# Altium schematic sheet power.SchDoc
size A4; SheetNumber: 5; SheetTotal: 8
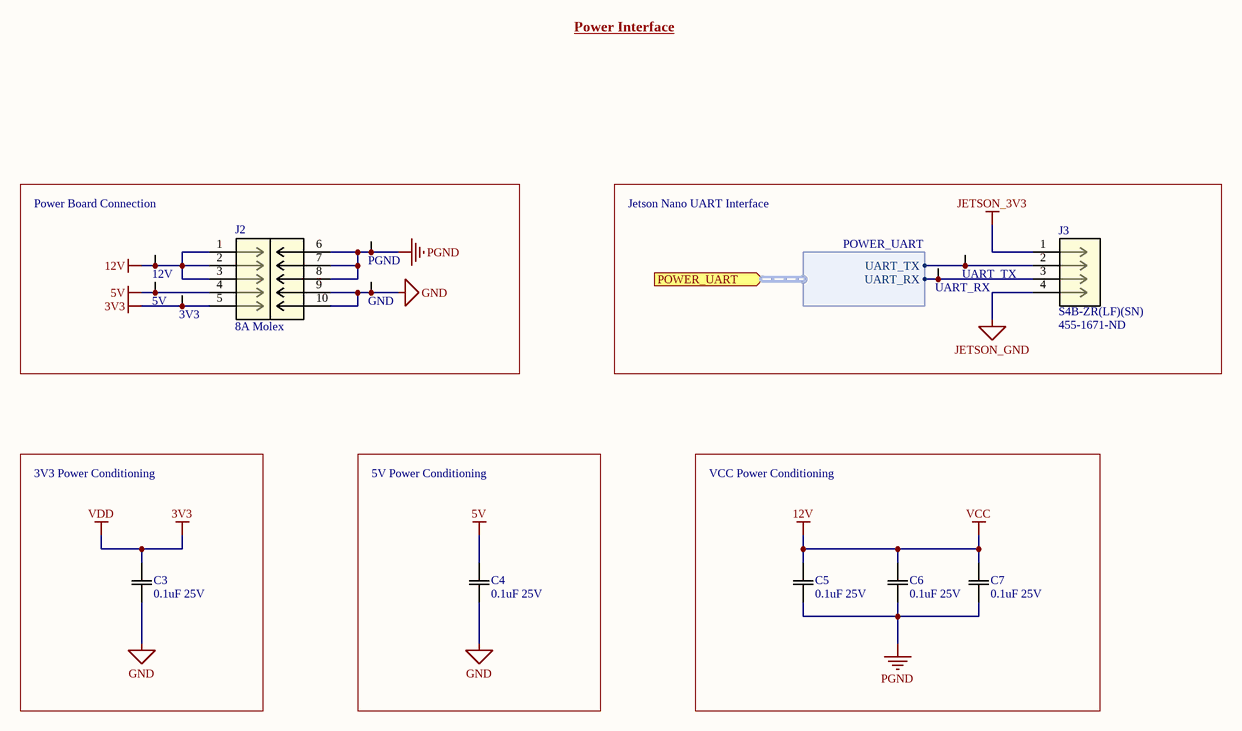
[diagram p0: power.SchDoc]

## Parts
3V3  Test Point (Via)  [TP]  (value not drawn)
5V  Test Point (Via)  [TP]  (value not drawn)
12V  Test Point (Via)  [TP]  (value not drawn)
C3  0.1uF 25V  [0805]
C4  0.1uF 25V  [0805]
C5  0.1uF 25V  [0805]
C6  0.1uF 25V  [0805]
C7  0.1uF 25V  [0805]
GND  Test Point (Via)  [TP]  (value not drawn)
J2  8A Molex  [MOLEX_0430451012]
J3  S4B-ZR(LF)(SN)  Supplier Part Number 1: 455-1671-ND  [CN S4B-ZR(LF)(SN)_JST]
PGND  Test Point (Via)  [TP]  (value not drawn)
UART_RX  Test Point (Via)  [TP]  (value not drawn)
UART_TX  Test Point (Via)  [TP]  (value not drawn)

## Blocks framed on the sheet
Power Board Connection: 3V3 5V 12V GND J2 PGND
Jetson Nano UART Interface: J3 UART_RX UART_TX
3V3 Power Conditioning: C3
5V Power Conditioning: C4
VCC Power Conditioning: C5-C7

## Ports
POWER_UART (in, harness POWER_UART)

## Harnesses
POWER_UART: UART_TX, UART_RX

## Nets
3V3: 3V3.1 C3.1(C1) J2.5  [also labelled VDD]
5V: 5V.1 C4.1(C1) J2.4
12V: 12V.1 C5.1(C1) C6.1(C1) C7.1(C1) J2.1 J2.2 J2.3  [also labelled VCC]
GND: C3.2(C2) C4.2(C2) GND.1 J2.9 J2.10
JETSON_3V3: J3.1
JETSON_GND: J3.4
PGND: C5.2(C2) C6.2(C2) C7.2(C2) J2.6 J2.7 J2.8 PGND.1
NetJ3_2: J3.2 UART_TX.1 ; port POWER_UART.UART_TX
NetJ3_3: J3.3 UART_RX.1 ; port POWER_UART.UART_RX

## Notes on the sheet
- Power Interface

## Library data of the parts
C3-C7 = CAP 0.1uF 25V: CAP CER 0.1UF 25V X7R 0805/0603; Tolerance: 10%; Value: 0.1uF; Temperature Coefficient: X7R; Rating: 25V; Operating Temperature: -55°C ~ 125°C
J2 = CN HDR 10POS MOLEX 0430451012: CONN HEADER VERT 10POS 3MM; Number of Terminals/Pins: 10; Contact Resistance: 10mR; Connector Type: Male Pin; Number of Ports: 1; Max Voltage Rating (AC): 250V; Pitch: 0.118inch; Supplier 1: Digi-Key; Manufacturer: Molex; Manufacturer Part Number: 0430451012; RoHS: Yes; Category: Headers and Wire Housings; Stock 1: 22123; Pricing 1: 1=2.46000, 10=2.09300, 80=1.72925, 1224=1.36521, 6120=1.21049 (USD); Mount: Through Hole; Color: Black; Contact Material: Brass; Contact Plating: Tin; Housing Color: Black; Housing Material: Polymer; Min Operating Temperature: -40°C; Max Operating Temperature: 105°C; Packaging: Tray; Number of Rows: 2; Number of Positions: 10; Termination: Solder; Number of Contacts: 10; Orientation: Straight; Series: Micro-Fit 3.0™ 43045; Fastening Type: Ramp; Contact Type: Male Pin; Length: 19.15mm; Row Spacing: 0.118inch; Depth: 8.77mm; Flammability Rating: UL94 V-0; RoHS Compliant: Yes; ComponentLink1URL: http://components.arrow.com/part/dataview/0323_01052363?src-supplier=Arrow+Europe; ComponentLink1Description: http://components.arrow.com/part/dataview/0323_01052363?src-supplier=Arrow+Europe; ComponentLink2URL: http://components.arrow.com/part/dataview/2943140S3689940N3303?src-supplier=Arrow+Electronics; ComponentLink2Description: http://components.arrow.com/part/dataview/2943140S3689940N3303?src-supplier=Arrow+Electronics; Supplier Part Number 1: WM1793-ND
J3 = CN HDR 4POS JST ZR: Connector Header Through Hole, Right Angle 4 position 0.059" (1.50mm); Mfr_Name: JST; Copyright: Copyright (C) 2021 Ultra Librarian. All rights reserved.; Manufacturer_Part_Number: S4B-ZR(LF)(SN); Digi-Key_Part_Number_1: 455-1671-ND; RefDes: RefDes; Type: DEV; Supplier 1: Digi-Key